# Altium project ALU_AND.PrjPcb
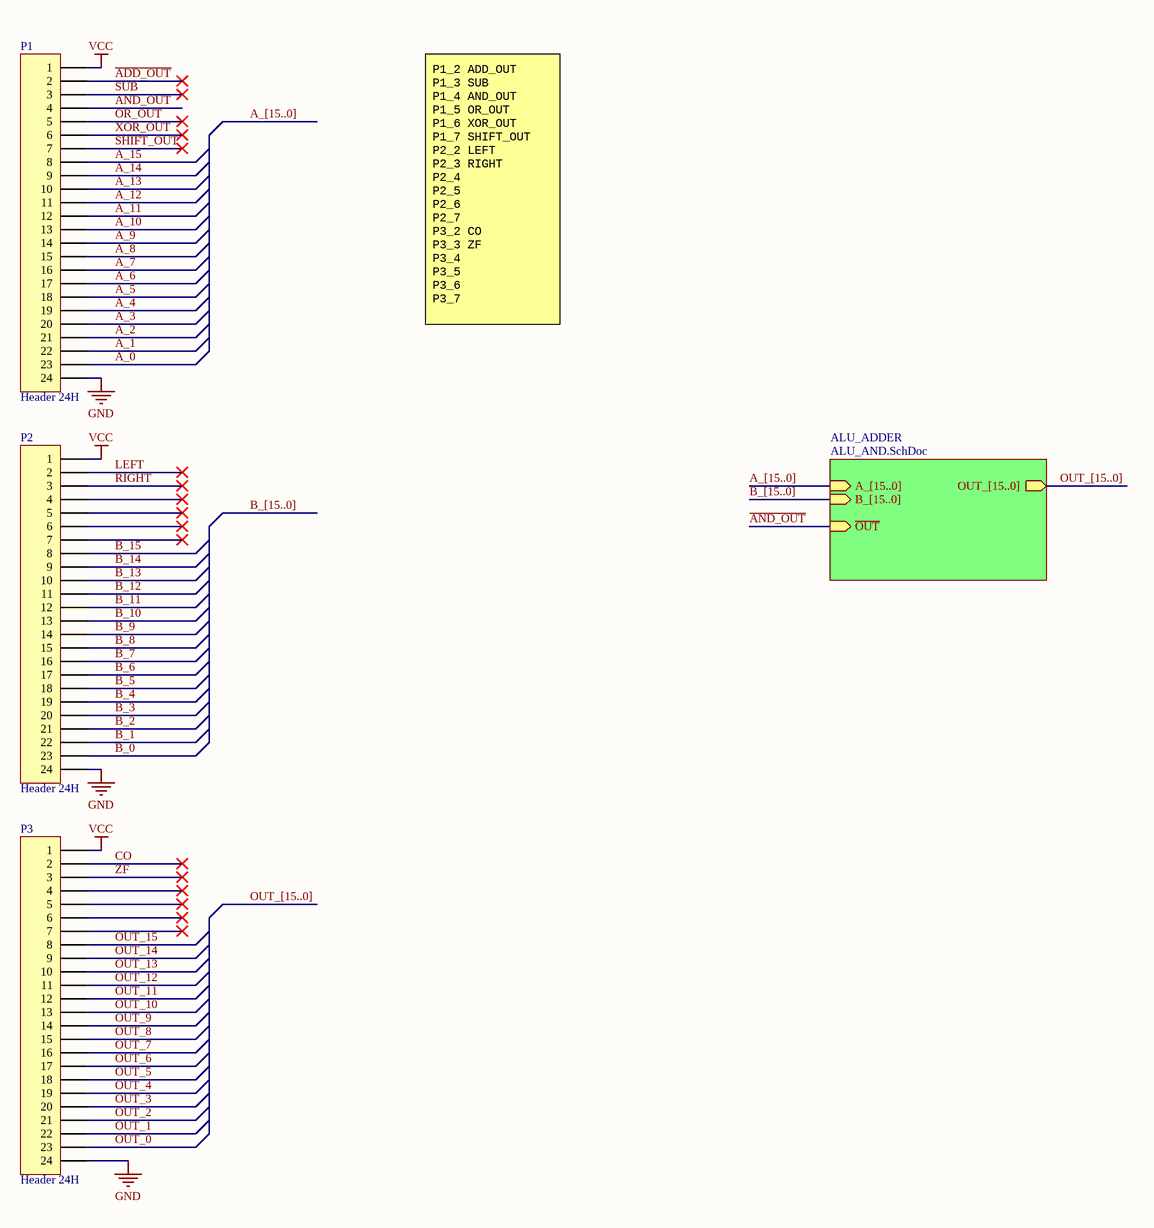
[diagram p0: Connectors.SchDoc]
2 sheets, 9 parts. Net scope: hierarchical (ports join the sheet entries above them; power ports are global).
Board file: ALU_AND.PcbDoc
Sheets:
  Connectors.SchDoc
    ALU_ADDER = ALU_AND.SchDoc

## Sheet Connectors.SchDoc
size B; Author: E. Sims; Organization: Let's Build Rockets Inc.; SheetNumber: 1; SheetTotal: 2

### Parts
P1  Header 24H  [HDR1X24H]
P2  Header 24H  [HDR1X24H]
P3  Header 24H  [HDR1X24H]

### Sub-sheets
ALU_ADDER = ALU_AND.SchDoc: B_[15..0] (in), ~{OUT} (in), OUT_[15..0] (out), A_[15..0] (in)

### Nets
GND: P1.24 P2.24 P3.24
VCC: P1.1 P2.1 P3.1
~{ADD_OUT}: P1.2
~{AND_OUT}: P1.4 ; sheet ALU_ADDER/~{OUT}
A_0: P1.23
A_1: P1.22
A_2: P1.21
A_3: P1.20
A_4: P1.19
A_5: P1.18
A_6: P1.17
A_7: P1.16
A_8: P1.15
A_9: P1.14
A_10: P1.13
A_11: P1.12
A_12: P1.11
A_13: P1.10
A_14: P1.9
A_15: P1.8
B_0: P2.23
B_1: P2.22
B_2: P2.21
B_3: P2.20
B_4: P2.19
B_5: P2.18
B_6: P2.17
B_7: P2.16
B_8: P2.15
B_9: P2.14
B_10: P2.13
B_11: P2.12
B_12: P2.11
B_13: P2.10
B_14: P2.9
B_15: P2.8
CO: P3.2
LEFT: P2.2
~{OR_OUT}: P1.5
OUT_0: P3.23
OUT_1: P3.22
OUT_2: P3.21
OUT_3: P3.20
OUT_4: P3.19
OUT_5: P3.18
OUT_6: P3.17
OUT_7: P3.16
OUT_8: P3.15
OUT_9: P3.14
OUT_10: P3.13
OUT_11: P3.12
OUT_12: P3.11
OUT_13: P3.10
OUT_14: P3.9
OUT_15: P3.8
RIGHT: P2.3
~{SHIFT_OUT}: P1.7
SUB: P1.3
~{XOR_OUT}: P1.6
~{ZF}: P3.3

Not connected (* = marked no-connect by the designer): P2 4* 5* 6* 7*; P3 4* 5* 6* 7*

### Buses and harness runs
bus A_[15..0]
bus A_[15..0] = sheet ALU_ADDER/A_[15..0]
bus B_[15..0]
bus B_[15..0] = sheet ALU_ADDER/B_[15..0]
bus OUT_[15..0]
bus OUT_[15..0] = sheet ALU_ADDER/OUT_[15..0]

### Notes on the sheet
- P1_2 ADD_OUT
  P1_3 SUB
  P1_4 AND_OUT
  P1_5 OR_OUT
  P1_6 XOR_OUT
  P1_7 SHIFT_OUT
  P2_2 LEFT
  P2_3 RIGHT
  P2_4
  P2_5
  P2_6
  P2_7
  P3_2 CO
  P3_3 ZF
  P3_4
  P3_5
  P3_6
  P3_7
- Let's Build Rocket's Inc. Modular Paylaod System Based on TMP-010 Rev
  For more information visit https://github.com/LetsBuildRockets/Modular-Payload-System
  This work is licensed under CC BY-NC 4.0. To view a copy of this license, visit https://creativecommons.org/licenses/by-nc/4.0
- Title
- Size:
- Date:
- Assembly Variant:
- B
- Number:
- Time:
- Revision:
- Sheet
- of
- Author:
- File:

### Library data of the parts
P1-P3 = Header 24H: Header, 24-Pin, Right Angle; LatestRevisionDate: 17-Jul-2002; LatestRevisionNote: Re-released for DXP Platform.; Publisher: Altium Limited

## Sheet ALU_AND.SchDoc
size B; Author: E. Sims; Organization: Let's Build Rockets Inc.; SheetNumber: 12; SheetTotal: 16
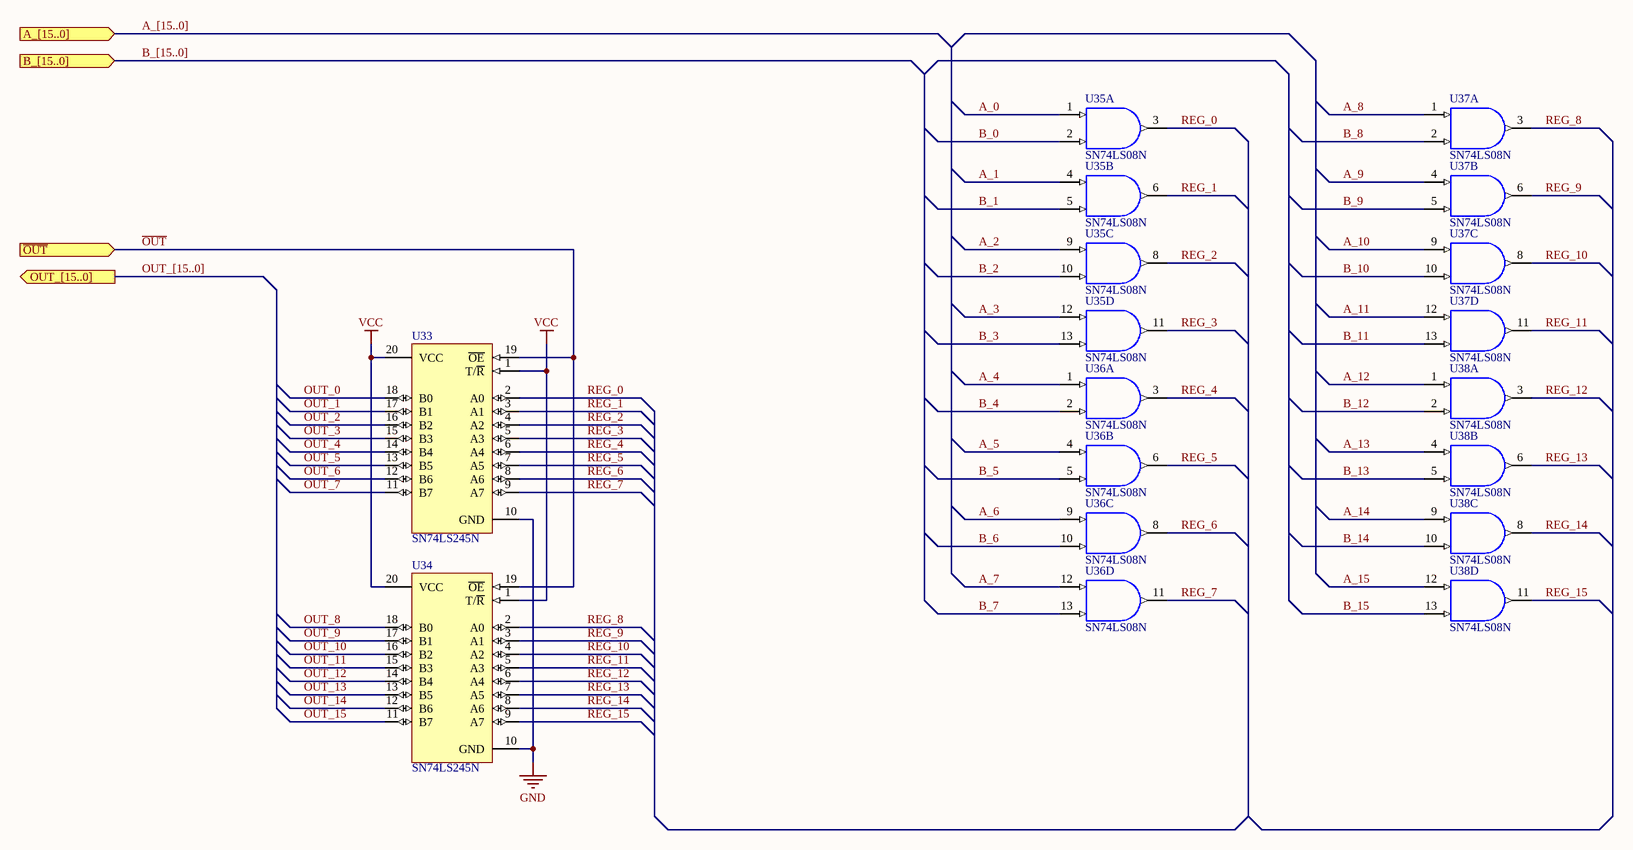
[diagram p1: ALU_AND.SchDoc]

### Parts
U33  SN74LS245N  [N020]
U34  SN74LS245N  [N020]
U35  SN74LS08N  [N014]  (parts A,B,C,D of 4)
U36  SN74LS08N  [N014]  (parts A,B,C,D of 4)
U37  SN74LS08N  [N014]  (parts A,B,C,D of 4)
U38  SN74LS08N  [N014]  (parts A,B,C,D of 4)

### Ports
A_[15..0] (in), B_[15..0] (in), OUT_[15..0] (out), ~{OUT} (in)

### Nets
GND: U33.10(GND) U34.10(GND) U35.7(GND) U36.7(GND) U37.7(GND) U38.7(GND)
VCC: U33.1(T/~{R}) U33.20(VCC) U34.1(T/~{R}) U34.20(VCC) U35.14(VCC) U36.14(VCC) U37.14(VCC) U38.14(VCC)
A_0: U35.1(A)
A_1: U35.4(A)
A_2: U35.9(A)
A_3: U35.12(A)
A_4: U36.1(A)
A_5: U36.4(A)
A_6: U36.9(A)
A_7: U36.12(A)
A_8: U37.1(A)
A_9: U37.4(A)
A_10: U37.9(A)
A_11: U37.12(A)
A_12: U38.1(A)
A_13: U38.4(A)
A_14: U38.9(A)
A_15: U38.12(A)
B_0: U35.2(B)
B_1: U35.5(B)
B_2: U35.10(B)
B_3: U35.13(B)
B_4: U36.2(B)
B_5: U36.5(B)
B_6: U36.10(B)
B_7: U36.13(B)
B_8: U37.2(B)
B_9: U37.5(B)
B_10: U37.10(B)
B_11: U37.13(B)
B_12: U38.2(B)
B_13: U38.5(B)
B_14: U38.10(B)
B_15: U38.13(B)
~{OUT}: U33.19(~{OE}) U34.19(~{OE}) ; port ~{OUT}  [project net ~{AND_OUT}]
OUT_0: U33.18(B0)
OUT_1: U33.17(B1)
OUT_2: U33.16(B2)
OUT_3: U33.15(B3)
OUT_4: U33.14(B4)
OUT_5: U33.13(B5)
OUT_6: U33.12(B6)
OUT_7: U33.11(B7)
OUT_8: U34.18(B0)
OUT_9: U34.17(B1)
OUT_10: U34.16(B2)
OUT_11: U34.15(B3)
OUT_12: U34.14(B4)
OUT_13: U34.13(B5)
OUT_14: U34.12(B6)
OUT_15: U34.11(B7)
REG_0: U33.2(A0) U35.3(Y)
REG_1: U33.3(A1) U35.6(Y)
REG_2: U33.4(A2) U35.8(Y)
REG_3: U33.5(A3) U35.11(Y)
REG_4: U33.6(A4) U36.3(Y)
REG_5: U33.7(A5) U36.6(Y)
REG_6: U33.8(A6) U36.8(Y)
REG_7: U33.9(A7) U36.11(Y)
REG_8: U34.2(A0) U37.3(Y)
REG_9: U34.3(A1) U37.6(Y)
REG_10: U34.4(A2) U37.8(Y)
REG_11: U34.5(A3) U37.11(Y)
REG_12: U34.6(A4) U38.3(Y)
REG_13: U34.7(A5) U38.6(Y)
REG_14: U34.8(A6) U38.8(Y)
REG_15: U34.9(A7) U38.11(Y)

### Buses and harness runs
bus A_[15..0] = port A_[15..0]
bus B_[15..0] = port B_[15..0]
bus OUT_[15..0] = port OUT_[15..0]

### Notes on the sheet
- Let's Build Rocket's Inc. Modular Paylaod System Based on TMP-010 Rev
  For more information visit https://github.com/LetsBuildRockets/Modular-Payload-System
  This work is licensed under CC BY-NC 4.0. To view a copy of this license, visit https://creativecommons.org/licenses/by-nc/4.0
- Title
- Size:
- Date:
- Assembly Variant:
- B
- Number:
- Time:
- Revision:
- Sheet
- of
- Author:
- File:

### Library data of the parts
U33 U34 = SN74LS245N: Octal Bus Transceiver with 3-State Outputs; Published: 8-Jun-2000; LatestRevisionDate: 04-Mar-2005; LatestRevisionNote: Stylized 3D Model Added.; DatasheetVersion: Mar-1988; PackageVersion: Oct-1995; PackageReference: N020; Publisher: Altium Limited; PackageDescription: DIP; 20 Leads; Row Spacing 7.62 mm; Pitch 2.54 mm; ComponentLink1Description: Manufacturer Link; ComponentLink1URL: http://www.ti.com/; ComponentLink2Description: Datasheet; ComponentLink2URL: http://www-s.ti.com/sc/ds/sn74ls245.pdf
U35-U38 = SN74LS08N: Quadruple 2-Input Positive-AND Gate; Published: 8-Jun-2000; LatestRevisionDate: 04-Mar-2005; LatestRevisionNote: Stylized 3D Model Added.; DatasheetVersion: Mar-1988; PackageVersion: Oct-1995; PackageReference: N014; Publisher: Altium Limited; PackageDescription: DIP; 14 Leads; Row Spacing 7.62 mm; Pitch 2.54 mm; ComponentLink1Description: Manufacturer Link; ComponentLink1URL: http://www.ti.com/; ComponentLink2Description: Datasheet; ComponentLink2URL: http://www-s.ti.com/sc/ds/SN74LS08.pdf

## Nets that join several sheets
GND: Connectors (P1.24 P2.24 P3.24), ALU_AND (6 pins)
VCC: Connectors (P1.1 P2.1 P3.1), ALU_AND (8 pins)
~{AND_OUT}: Connectors (P1.4), ALU_AND (U33.19 U34.19)
A_0: Connectors (P1.23), ALU_AND (U35.1)
A_1: Connectors (P1.22), ALU_AND (U35.4)
A_2: Connectors (P1.21), ALU_AND (U35.9)
A_3: Connectors (P1.20), ALU_AND (U35.12)
A_4: Connectors (P1.19), ALU_AND (U36.1)
A_5: Connectors (P1.18), ALU_AND (U36.4)
A_6: Connectors (P1.17), ALU_AND (U36.9)
A_7: Connectors (P1.16), ALU_AND (U36.12)
A_8: Connectors (P1.15), ALU_AND (U37.1)
A_9: Connectors (P1.14), ALU_AND (U37.4)
A_10: Connectors (P1.13), ALU_AND (U37.9)
A_11: Connectors (P1.12), ALU_AND (U37.12)
A_12: Connectors (P1.11), ALU_AND (U38.1)
A_13: Connectors (P1.10), ALU_AND (U38.4)
A_14: Connectors (P1.9), ALU_AND (U38.9)
A_15: Connectors (P1.8), ALU_AND (U38.12)
B_0: Connectors (P2.23), ALU_AND (U35.2)
B_1: Connectors (P2.22), ALU_AND (U35.5)
B_2: Connectors (P2.21), ALU_AND (U35.10)
B_3: Connectors (P2.20), ALU_AND (U35.13)
B_4: Connectors (P2.19), ALU_AND (U36.2)
B_5: Connectors (P2.18), ALU_AND (U36.5)
B_6: Connectors (P2.17), ALU_AND (U36.10)
B_7: Connectors (P2.16), ALU_AND (U36.13)
B_8: Connectors (P2.15), ALU_AND (U37.2)
B_9: Connectors (P2.14), ALU_AND (U37.5)
B_10: Connectors (P2.13), ALU_AND (U37.10)
B_11: Connectors (P2.12), ALU_AND (U37.13)
B_12: Connectors (P2.11), ALU_AND (U38.2)
B_13: Connectors (P2.10), ALU_AND (U38.5)
B_14: Connectors (P2.9), ALU_AND (U38.10)
B_15: Connectors (P2.8), ALU_AND (U38.13)
OUT_0: Connectors (P3.23), ALU_AND (U33.18)
OUT_1: Connectors (P3.22), ALU_AND (U33.17)
OUT_2: Connectors (P3.21), ALU_AND (U33.16)
OUT_3: Connectors (P3.20), ALU_AND (U33.15)
OUT_4: Connectors (P3.19), ALU_AND (U33.14)
OUT_5: Connectors (P3.18), ALU_AND (U33.13)
OUT_6: Connectors (P3.17), ALU_AND (U33.12)
OUT_7: Connectors (P3.16), ALU_AND (U33.11)
OUT_8: Connectors (P3.15), ALU_AND (U34.18)
OUT_9: Connectors (P3.14), ALU_AND (U34.17)
OUT_10: Connectors (P3.13), ALU_AND (U34.16)
OUT_11: Connectors (P3.12), ALU_AND (U34.15)
OUT_12: Connectors (P3.11), ALU_AND (U34.14)
OUT_13: Connectors (P3.10), ALU_AND (U34.13)
OUT_14: Connectors (P3.9), ALU_AND (U34.12)
OUT_15: Connectors (P3.8), ALU_AND (U34.11)